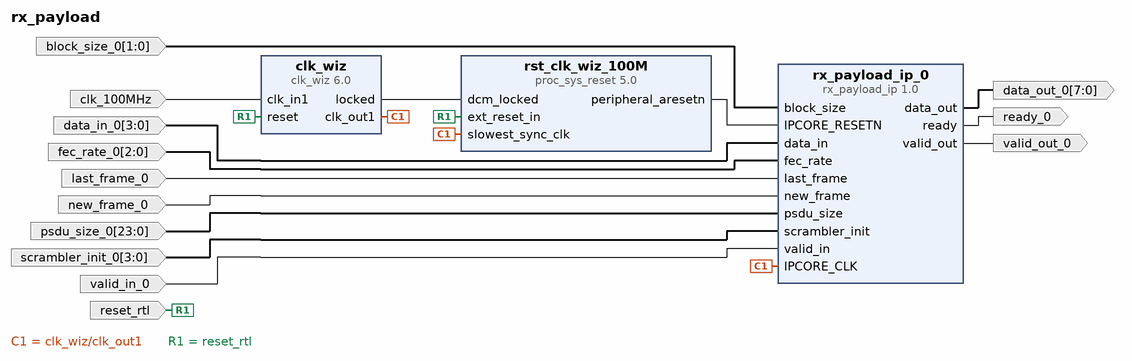
[diagram p0: block diagram of the top level]
# Vivado block design rx_payload, xc7z010clg400-1, Vivado 2023.2
create_bd_design rx_payload

create_bd_port -dir I -type clk clk_100MHz
set_property -dict {CONFIG.FREQ_HZ 125000000} [get_bd_ports clk_100MHz]
create_bd_port -dir I -type rst reset_rtl
set_property -dict {CONFIG.POLARITY ACTIVE_HIGH} [get_bd_ports reset_rtl]
create_bd_port -dir I -from 1 -to 0 block_size_0
create_bd_port -dir I -from 3 -to 0 data_in_0
create_bd_port -dir O -from 7 -to 0 data_out_0
create_bd_port -dir I -from 2 -to 0 fec_rate_0
create_bd_port -dir I last_frame_0
create_bd_port -dir I new_frame_0
create_bd_port -dir I -from 23 -to 0 psdu_size_0
create_bd_port -dir O ready_0
create_bd_port -dir I -from 3 -to 0 scrambler_init_0
create_bd_port -dir I valid_in_0
create_bd_port -dir O valid_out_0

create_bd_cell -type ip -vlnv user.org:ip:rx_payload_ip:1.0 rx_payload_ip_0
create_bd_cell -type ip -vlnv xilinx.com:ip:clk_wiz:6.0 clk_wiz
set_property -dict [list \
  CONFIG.CLKIN1_JITTER_PS 80.0 \
  CONFIG.CLKOUT1_JITTER 119.348 \
  CONFIG.CLKOUT1_PHASE_ERROR 96.948 \
  CONFIG.CLKOUT1_REQUESTED_OUT_FREQ 125 \
  CONFIG.MMCM_CLKFBOUT_MULT_F 8.000 \
  CONFIG.MMCM_CLKIN1_PERIOD 8.000 \
  CONFIG.MMCM_CLKIN2_PERIOD 10.000 \
  CONFIG.MMCM_CLKOUT0_DIVIDE_F 8.000 \
  CONFIG.PRIM_IN_FREQ 125 \
] [get_bd_cells clk_wiz]
create_bd_cell -type ip -vlnv xilinx.com:ip:proc_sys_reset:5.0 rst_clk_wiz_100M

# ---- connections ----

connect_bd_net -net block_size_0_1 [get_bd_ports block_size_0] [get_bd_pins rx_payload_ip_0/block_size]
connect_bd_net [get_bd_ports clk_100MHz] [get_bd_pins clk_wiz/clk_in1]
connect_bd_net [get_bd_pins clk_wiz/clk_out1] [get_bd_pins rst_clk_wiz_100M/slowest_sync_clk] [get_bd_pins rx_payload_ip_0/IPCORE_CLK]
connect_bd_net [get_bd_pins clk_wiz/locked] [get_bd_pins rst_clk_wiz_100M/dcm_locked]
connect_bd_net -net data_in_0_1 [get_bd_ports data_in_0] [get_bd_pins rx_payload_ip_0/data_in]
connect_bd_net -net fec_rate_0_1 [get_bd_ports fec_rate_0] [get_bd_pins rx_payload_ip_0/fec_rate]
connect_bd_net -net last_frame_0_1 [get_bd_ports last_frame_0] [get_bd_pins rx_payload_ip_0/last_frame]
connect_bd_net -net new_frame_0_1 [get_bd_ports new_frame_0] [get_bd_pins rx_payload_ip_0/new_frame]
connect_bd_net -net psdu_size_0_1 [get_bd_ports psdu_size_0] [get_bd_pins rx_payload_ip_0/psdu_size]
connect_bd_net [get_bd_ports reset_rtl] [get_bd_pins clk_wiz/reset] [get_bd_pins rst_clk_wiz_100M/ext_reset_in]
connect_bd_net [get_bd_pins rst_clk_wiz_100M/peripheral_aresetn] [get_bd_pins rx_payload_ip_0/IPCORE_RESETN]
connect_bd_net [get_bd_pins rx_payload_ip_0/data_out] [get_bd_ports data_out_0]
connect_bd_net [get_bd_pins rx_payload_ip_0/ready] [get_bd_ports ready_0]
connect_bd_net [get_bd_pins rx_payload_ip_0/valid_out] [get_bd_ports valid_out_0]
connect_bd_net -net scrambler_init_0_1 [get_bd_ports scrambler_init_0] [get_bd_pins rx_payload_ip_0/scrambler_init]
connect_bd_net -net valid_in_0_1 [get_bd_ports valid_in_0] [get_bd_pins rx_payload_ip_0/valid_in]

validate_bd_design
save_bd_design
